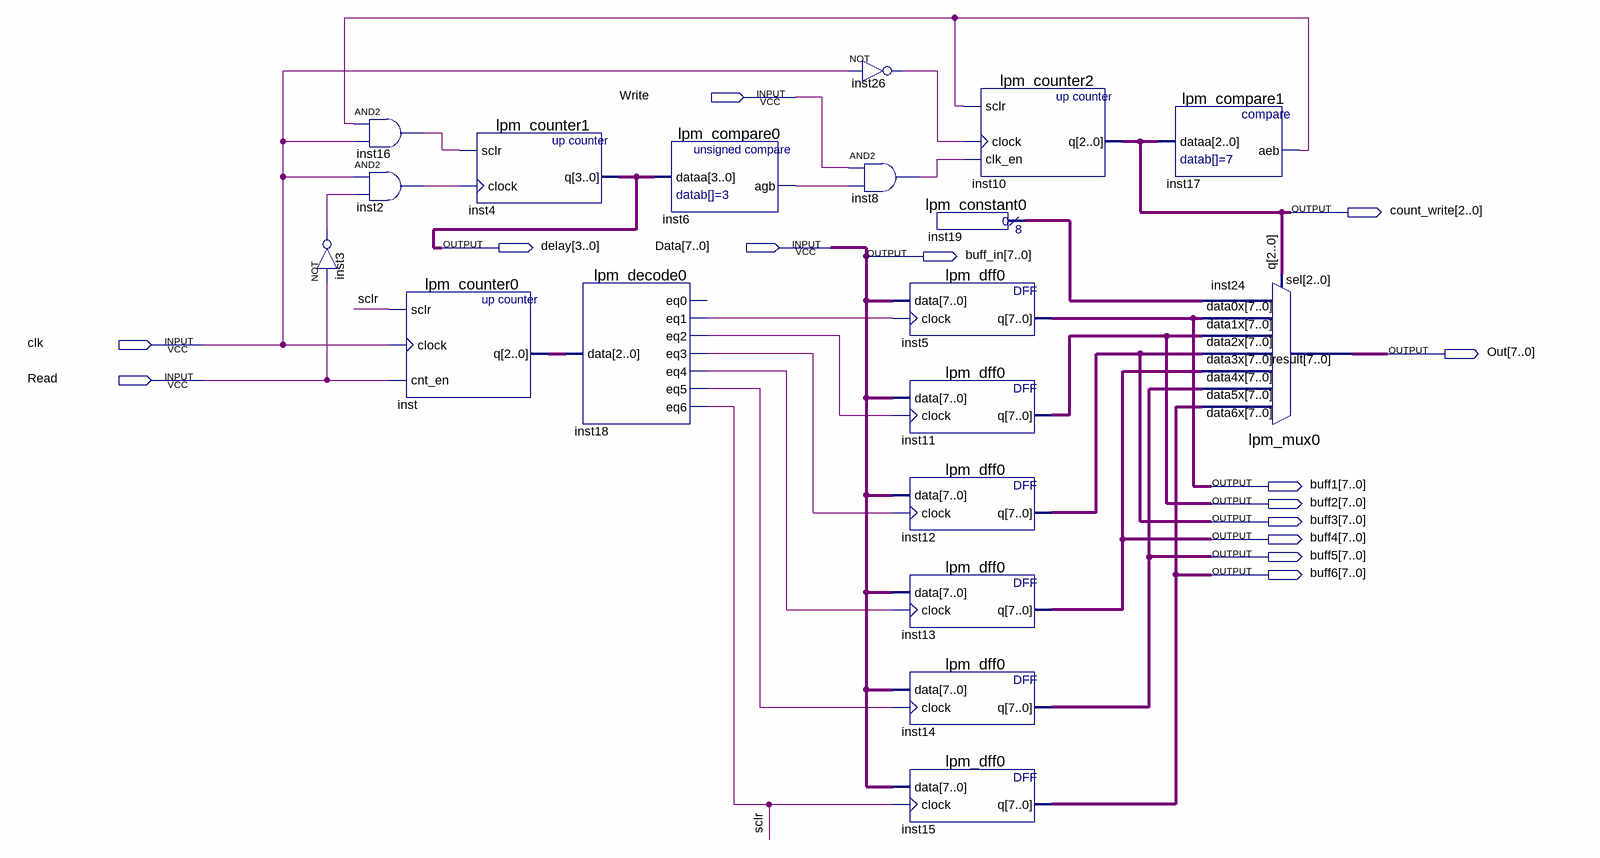
[diagram p0: schematic sheet]
// Quartus schematic buffer.bdf as structural Verilog: 19 symbols, 14 pins
module buffer (
  input  Write,
  input  [7:0] Data,
  input  clk,
  input  Read,
  output [2:0] count_write,
  output [3:0] delay,
  output [7:0] buff_in,
  output [7:0] Out,
  output [7:0] buff1,
  output [7:0] buff2,
  output [7:0] buff3,
  output [7:0] buff4,
  output [7:0] buff5,
  output [7:0] buff6
);

  wire inst2_out, inst3_out, inst6_agb, inst8_out, inst16_out, inst17_aeb, inst18_eq1, inst18_eq2,
       inst18_eq3, inst18_eq4, inst18_eq5, inst26_out, sclr;
  wire [2:0] inst_q;
  wire [7:0] inst19_result;

  and inst16 (inst16_out, inst17_aeb, clk);
  and inst2 (inst2_out, clk, inst3_out);
  not inst3 (inst3_out, Read);
  lpm_counter0 inst (.sclr(sclr), .clock(clk), .cnt_en(Read), .q(inst_q));
  lpm_counter1 inst4 (.sclr(inst16_out), .clock(inst2_out), .q(delay));
  lpm_decode0 inst18 (
    .data(inst_q), .eq1(inst18_eq1), .eq2(inst18_eq2), .eq3(inst18_eq3), .eq4(inst18_eq4), .eq5(inst18_eq5),
    .eq6(sclr));  // open: eq0
  lpm_compare0 inst6 (.dataa(delay), .agb(inst6_agb));
  not inst26 (inst26_out, clk);
  and inst8 (inst8_out, Write, inst6_agb);
  lpm_constant0 inst19 (.result(inst19_result));
  lpm_dff0 inst5 (.data(Data), .clock(inst18_eq1), .q(buff1));
  lpm_dff0 inst11 (.data(Data), .clock(inst18_eq2), .q(buff2));
  lpm_dff0 inst12 (.data(Data), .clock(inst18_eq3), .q(buff3));
  lpm_dff0 inst13 (.data(Data), .clock(inst18_eq4), .q(buff4));
  lpm_dff0 inst14 (.data(Data), .clock(inst18_eq5), .q(buff5));
  lpm_dff0 inst15 (.data(Data), .clock(sclr), .q(buff6));
  lpm_counter2 inst10 (.sclr(inst17_aeb), .clock(inst26_out), .clk_en(inst8_out), .q(count_write));
  lpm_compare1 inst17 (.dataa(count_write), .aeb(inst17_aeb));
  lpm_mux0 inst24 (
    .data6x(buff6), .data5x(buff5), .data4x(buff4), .data3x(buff3), .data2x(buff2), .data1x(buff1),
    .data0x(inst19_result), .sel(count_write), .result(Out));

  assign buff_in = Data;

  // Other names for the same wires on the sheet: q[2:0] = count_write
endmodule
